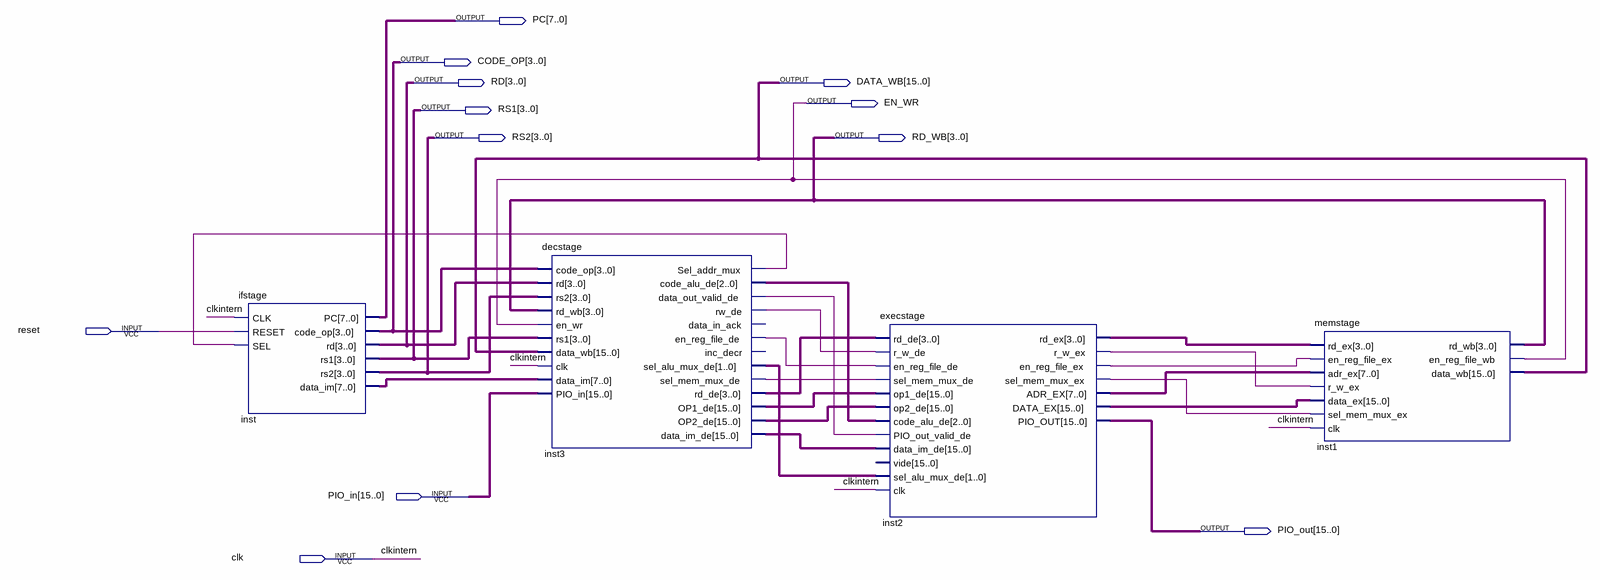
[diagram p0: schematic sheet]
// Quartus schematic proc.bdf as structural Verilog: 4 symbols, 12 pins
module proc (
  input  reset,
  input  [15:0] PIO_in,
  input  clk,
  output [7:0] PC,
  output [3:0] CODE_OP,
  output [3:0] RD,
  output [15:0] DATA_WB,
  output EN_WR,
  output [3:0] RS1,
  output [3:0] RS2,
  output [3:0] RD_WB,
  output [15:0] PIO_out
);

  wire inst2_en_reg_file_ex, inst2_r_w_ex, inst2_sel_mem_mux_ex, inst3_data_out_valid_de,
       inst3_en_reg_file_de, inst3_rw_de, inst3_sel_addr_mux, inst3_sel_mem_mux_de;
  wire [1:0] inst3_sel_alu_mux_de;
  wire [2:0] inst3_code_alu_de;
  wire [3:0] inst2_rd_ex, inst3_rd_de;
  wire [7:0] inst2_adr_ex, inst_data_im;
  wire [15:0] inst2_data_ex, inst3_data_im_de, inst3_op1_de, inst3_op2_de;

  ifstage inst (
    .CLK(clk), .RESET(reset), .SEL(inst3_sel_addr_mux), .PC(PC), .code_op(CODE_OP), .rd(RD), .rs1(RS1),
    .rs2(RS2), .data_im(inst_data_im));
  decstage inst3 (
    .code_op(CODE_OP), .rd(RD), .rs2(RS2), .rd_wb(RD_WB), .en_wr(EN_WR), .rs1(RS1), .data_wb(DATA_WB),
    .clk(clk), .data_im(inst_data_im), .PIO_in(PIO_in), .Sel_addr_mux(inst3_sel_addr_mux),
    .code_alu_de(inst3_code_alu_de), .data_out_valid_de(inst3_data_out_valid_de), .rw_de(inst3_rw_de),
    .en_reg_file_de(inst3_en_reg_file_de), .sel_alu_mux_de(inst3_sel_alu_mux_de),
    .sel_mem_mux_de(inst3_sel_mem_mux_de), .rd_de(inst3_rd_de), .OP1_de(inst3_op1_de), .OP2_de(inst3_op2_de),
    .data_im_de(inst3_data_im_de));  // open: data_in_ack, inc_decr
  execstage inst2 (
    .rd_de(inst3_rd_de), .r_w_de(inst3_rw_de), .en_reg_file_de(inst3_en_reg_file_de),
    .sel_mem_mux_de(inst3_sel_mem_mux_de), .op1_de(inst3_op1_de), .op2_de(inst3_op2_de),
    .code_alu_de(inst3_code_alu_de), .PIO_out_valid_de(inst3_data_out_valid_de),
    .data_im_de(inst3_data_im_de), .sel_alu_mux_de(inst3_sel_alu_mux_de), .clk(clk), .rd_ex(inst2_rd_ex),
    .r_w_ex(inst2_r_w_ex), .en_reg_file_ex(inst2_en_reg_file_ex), .sel_mem_mux_ex(inst2_sel_mem_mux_ex),
    .ADR_EX(inst2_adr_ex), .DATA_EX(inst2_data_ex), .PIO_OUT(PIO_out));  // open: vide
  memstage inst1 (
    .rd_ex(inst2_rd_ex), .en_reg_file_ex(inst2_en_reg_file_ex), .adr_ex(inst2_adr_ex), .r_w_ex(inst2_r_w_ex),
    .data_ex(inst2_data_ex), .sel_mem_mux_ex(inst2_sel_mem_mux_ex), .clk(clk), .rd_wb(RD_WB),
    .en_reg_file_wb(EN_WR), .data_wb(DATA_WB));

  // Other names for the same wires on the sheet: clkintern = clk
endmodule
